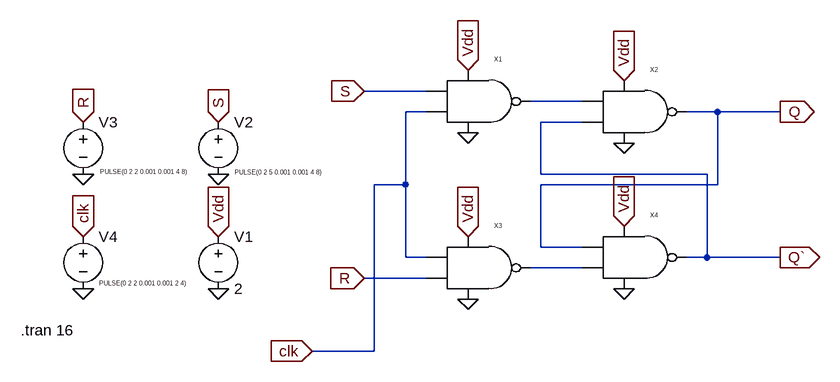
[diagram p0: schematic SR flip flop.asc]
SR flip flop.asc, the LTspice schematic file:
Version 4
SHEET 1 1372 680
WIRE 16 80 -80 80
WIRE 256 96 176 96
WIRE 16 112 -16 112
WIRE 464 112 416 112
WIRE 560 112 464 112
WIRE 256 128 192 128
WIRE 192 208 192 128
WIRE 448 208 192 208
WIRE -16 224 -16 112
WIRE -16 224 -64 224
WIRE 464 224 464 112
WIRE 464 224 192 224
WIRE 192 320 192 224
WIRE 256 320 192 320
WIRE -16 336 -16 224
WIRE 16 336 -16 336
WIRE 448 336 448 208
WIRE 448 336 416 336
WIRE 560 336 448 336
WIRE 256 352 176 352
WIRE 16 368 -80 368
WIRE -64 480 -64 224
WIRE -64 480 -160 480
FLAG -512 384 0
FLAG -512 208 0
FLAG -304 208 0
FLAG -304 384 0
FLAG 80 144 0
FLAG 80 400 0
FLAG 320 384 0
FLAG 320 160 0
FLAG -304 304 Vdd
IOPIN -304 304 In
FLAG 80 48 Vdd
IOPIN 80 48 In
FLAG 320 64 Vdd
IOPIN 320 64 In
FLAG 320 288 Vdd
IOPIN 320 288 In
FLAG 80 304 Vdd
IOPIN 80 304 In
FLAG -512 304 clk
IOPIN -512 304 In
FLAG -304 128 S
IOPIN -304 128 In
FLAG -80 80 S
IOPIN -80 80 In
FLAG -512 128 R
IOPIN -512 128 In
FLAG -80 368 R
IOPIN -80 368 In
FLAG 560 112 Q
IOPIN 560 112 Out
FLAG 560 336 Q`
IOPIN 560 336 Out
FLAG -160 480 clk
IOPIN -160 480 In
SYMBOL nand 80 96 R0
SYMATTR InstName X1
SYMBOL nand 320 112 R0
SYMATTR InstName X2
SYMBOL nand 80 352 R0
SYMATTR InstName X3
SYMBOL nand 320 336 R0
SYMATTR InstName X4
SYMBOL voltage -304 288 R0
WINDOW 123 0 0 Left 0
WINDOW 39 0 0 Left 0
SYMATTR InstName V1
SYMATTR Value 2
SYMBOL voltage -304 112 R0
WINDOW 3 25 93 Left 0
WINDOW 123 0 0 Left 0
WINDOW 39 0 0 Left 0
SYMATTR Value PULSE(0 2 5 0.001 0.001 4 8)
SYMATTR InstName V2
SYMBOL voltage -512 112 R0
WINDOW 3 26 92 Left 0
WINDOW 123 0 0 Left 0
WINDOW 39 0 0 Left 0
SYMATTR Value PULSE(0 2 2 0.001 0.001 4 8)
SYMATTR InstName V3
SYMBOL voltage -512 288 R0
WINDOW 3 25 88 Left 0
WINDOW 123 0 0 Left 0
WINDOW 39 0 0 Left 0
SYMATTR Value PULSE(0 2 2 0.001 0.001 2 4)
SYMATTR InstName V4
TEXT -608 448 Left 2 !.tran 16

The netlist it stands for:
* SR flip flop.asc
XX1 S clk Vdd 0 N001 nand  ; pins A B vdd gnd Y
XX2 N001 Q` Vdd 0 Q nand  ; pins A B vdd gnd Y
XX3 clk R Vdd 0 N002 nand  ; pins A B vdd gnd Y
XX4 Q N002 Vdd 0 Q` nand  ; pins A B vdd gnd Y
V1 Vdd 0 2
V2 S 0 PULSE(0 2 5 0.001 0.001 4 8)
V3 R 0 PULSE(0 2 2 0.001 0.001 4 8)
V4 clk 0 PULSE(0 2 2 0.001 0.001 2 4)
.tran 16
.backanno
.end

* Results of the author's LTspice run, read from the files saved beside the schematic
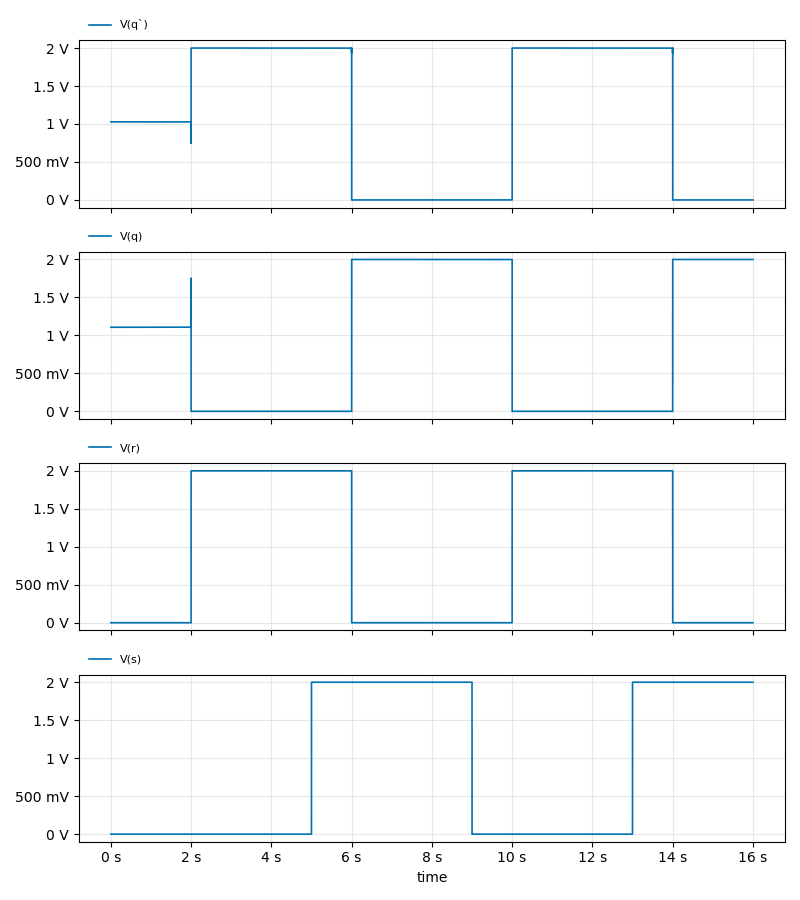
[diagram p1: Transient Analysis of SR flip flop.asc, plotted from the saved traces]
* Transient Analysis, 1 run:
*   V(q`): min 401 nV, max 2 V, average 1.129 V, rms 1.46 V, last 401 nV
*   V(q): min -1.816 µV, max 2 V, average 888.4 mV, rms 1.286 V, last 2 V
*   V(r): min 0 V, max 2 V, average 1 V, rms 1.414 V, last 0 V
*   V(s): min 0 V, max 2 V, average 875.1 mV, rms 1.323 V, last 2 V